# Altium schematic sheet POWER_SUPPLY.SchDoc
size A4; SheetNumber: 8; SheetTotal: 9
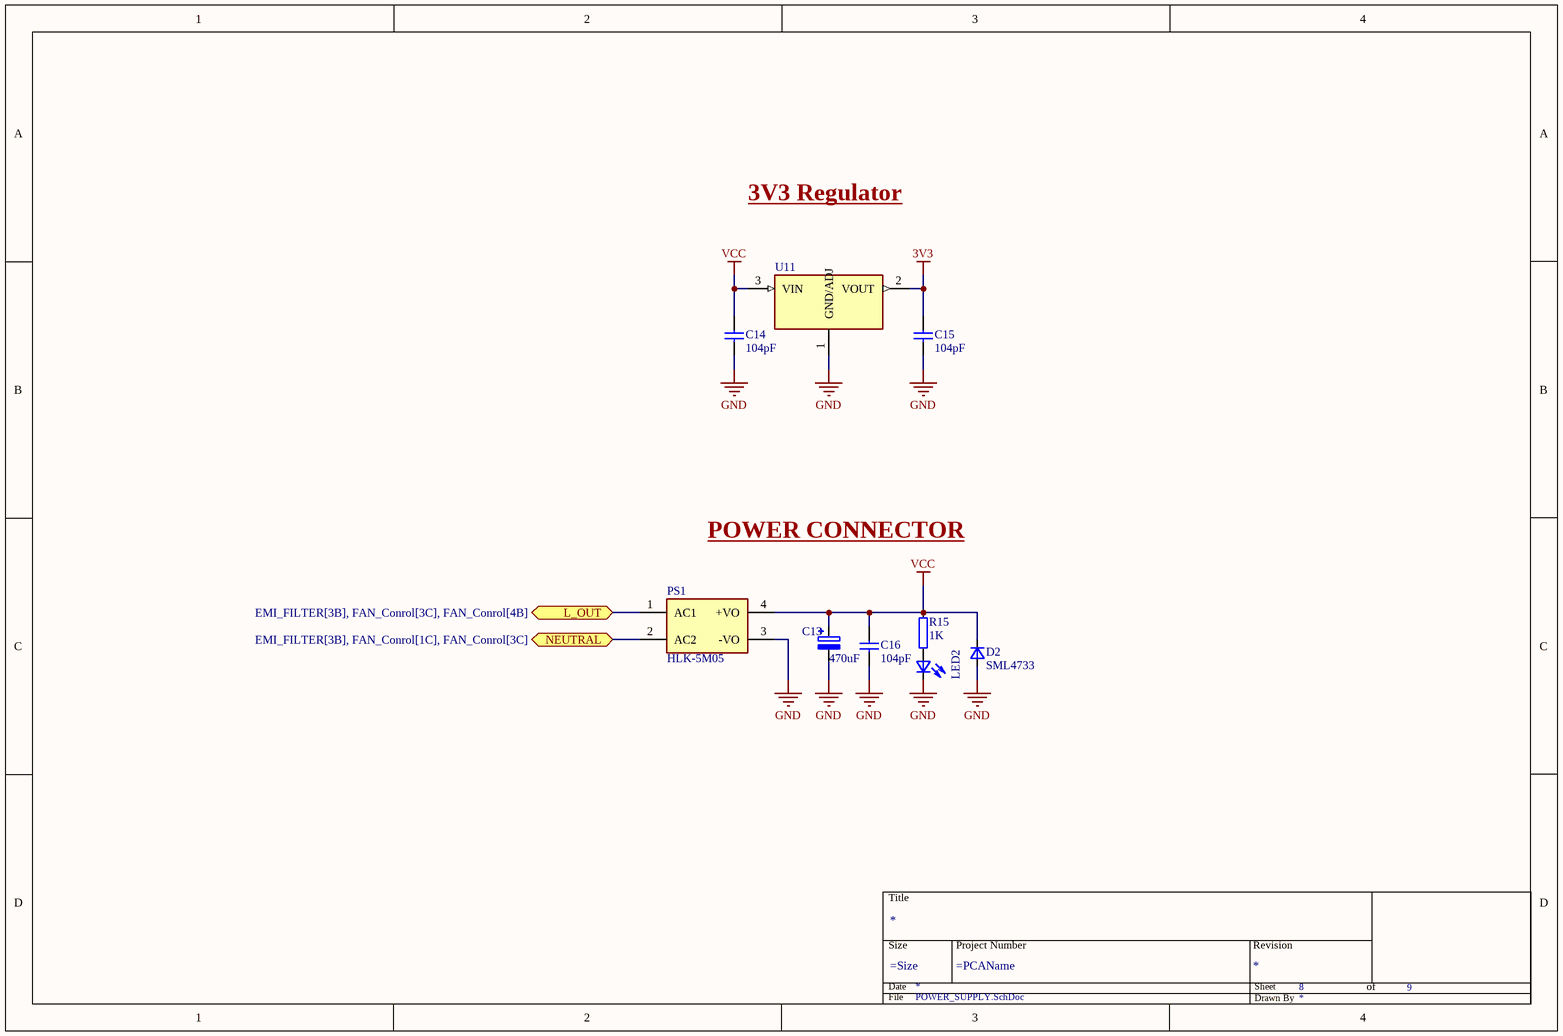
[diagram p0: POWER_SUPPLY.SchDoc]

## Parts
*  Title Block  (value not drawn)  (graphical)
C13  470uF  [CAPPRD500W60D1000H1300]
C14  104pF  [CAPC2012X140N]
C15  104pF  [CAPC2012X140N]
C16  104pF  [CAPC2012X140N]
D2  SML4733  [DO-214AC]
LED2  LED_0603  [LED_KP-2012]  (value not drawn)
PS1  HLK-5M05  [CONV_HLK-5M05]
R15  1K  [RESC2012X65N]
U11  AMS1117-3.3  [SOT229P700X180-4N]  (value not drawn)

## Ports
L_OUT (bidir, see EMI_FILTER[3B], FAN_Conrol[3C], FAN_Conrol[4B]), NEUTRAL (bidir, see EMI_FILTER[3B], FAN_Conrol[1C], FAN_Conrol[3C])

## Nets
3V3: C15.2 U11.2(VOUT)
GND: C13.2 C14.1 C15.1 C16.1 D2.1(ANNODE) LED2.2(Cathode) PS1.3(-VO) U11.1(GND/ADJ)
VCC: C13.1 C14.2 C16.2 D2.2(CATHODE) PS1.4(+VO) R15.2 U11.3(VIN)
L_OUT: PS1.1(AC1) ; port L_OUT
NEUTRAL: PS1.2(AC2) ; port NEUTRAL
NetLED2_1: LED2.1(Anode) R15.1

## Notes on the sheet
- 3V3 Regulator
- POWER CONNECTOR
- (in symbol Title Block) Title; Size; Project Number; Revision; Date; Sheet; of; File; Drawn By

## Library data of the parts
C13 = Electrolytic Capacitor: Aluminum Electrolytic Capacitors - Radial Leaded; Part Number: Cap Electrolytic; Manufacturer Part Number: Cap Electrolytic; Pin Count: 2; Publisher: Metal Circuits; Value: 470uF; FootPrint Doc: Radial-2
C14-C16 = CAP_0805: Part Number: CAP_0805; Pin Count: 2; Publisher: Metal Circuits; Value: 104pF
D2 = SML4733: Zener Diode Single 5.1V 10% 7Ohm 1000mW 2-Pin SMA; Part Number: SML4733; Manufacturer Part Number: SML4733; Pin Count: 2; Publisher: Metal Circuits; Value: SML4733; FootPrint Doc: DO-214AC
LED2 = LED_0603: LED SMD 0603; Part Number: LED_0603; Manufacturer Part Number: LED_0603; Pin Count: 2; Publisher: Metal Circuits; Value: LED_0603
PS1 = HLK-5M05: 5V 1A 90VAC~265VAC 120V~350V 5W AC-DC 69% Plugin Power Modules ROHS; Manufacturer: HI-LINK; Part Number: HLK-5M05; Manufacturer Part Number: HLK-5M05; Pin Count: 4; Publisher: Metal Circuits; Value: HLK-5M05
R15 = RES_0805: RES SMD 1% 1/10W 0805; Part Number: RES_0805; Pin Count: 2; Publisher: Metal Circuits; Value: 1K; FootPrint Doc: 0805
U11 = AMS1117-3.3: Sot223/Pkg 1-Amp 3.3-Volt Low Drop Out Voltage Regulatator; Manufacturer: AMS; Part Number: AMS1117-3.3; Manufacturer Part Number: AMS1117-3.3; Pin Count: 4; Publisher: Metal Circuits; Value: AMS1117-3.3; FootPrint Doc: SOT-223